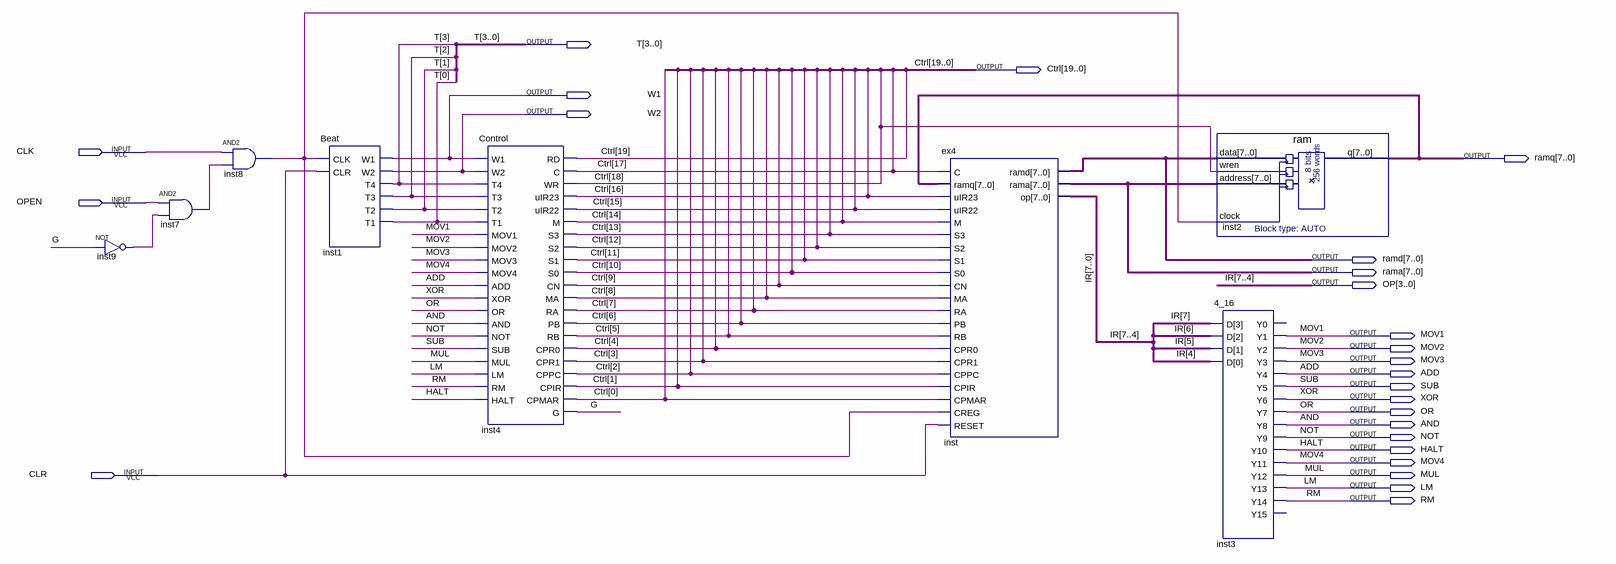
[diagram p0: schematic sheet]
// Quartus schematic lab4.bdf as structural Verilog: 8 symbols, 25 pins
module lab4 (
  input  CLK,
  input  OPEN,
  input  CLR,
  output [3:0] T,
  output [19:0] Ctrl,
  output W1,
  output W2,
  output [7:0] ramq,
  output [7:0] ramd,
  output [7:0] rama,
  output [3:0] OP,
  output MOV1,
  output MOV2,
  output MOV3,
  output ADD,
  output SUB,
  output XOR,
  output OR,
  output AND,
  output NOT,
  output HALT,
  output MOV4,
  output MUL,
  output LM,
  output RM
);

  wire G, inst7_out, inst8_out, inst9_out;
  wire [3:0] IR;

  not inst9 (inst9_out, G);
  and inst7 (inst7_out, OPEN, inst9_out);
  and inst8 (inst8_out, CLK, inst7_out);
  Beat inst1 (.CLK(inst8_out), .CLR(CLR), .W1(W1), .W2(W2), .T4(T[3]), .T3(T[2]), .T2(T[1]), .T1(T[0]));
  Control inst4 (
    .W1(W1), .W2(W2), .T4(T[3]), .T3(T[2]), .T2(T[1]), .T1(T[0]), .MOV1(MOV1), .MOV2(MOV2), .MOV3(MOV3),
    .MOV4(MOV4), .ADD(ADD), .XOR(XOR), .OR(OR), .AND(AND), .NOT(NOT), .SUB(SUB), .MUL(MUL), .LM(LM), .RM(RM),
    .HALT(HALT), .RD(Ctrl[19]), .C(Ctrl[17]), .WR(Ctrl[18]), .uIR23(Ctrl[16]), .uIR22(Ctrl[15]),
    .M(Ctrl[14]), .S3(Ctrl[13]), .S2(Ctrl[12]), .S1(Ctrl[11]), .S0(Ctrl[10]), .CN(Ctrl[9]), .MA(Ctrl[8]),
    .RA(Ctrl[7]), .PB(Ctrl[6]), .RB(Ctrl[5]), .CPR0(Ctrl[4]), .CPR1(Ctrl[3]), .CPPC(Ctrl[2]), .CPIR(Ctrl[1]),
    .CPMAR(Ctrl[0]), .G(G));
  ex4 inst (
    .C(Ctrl[17]), .ramq(ramq), .uIR23(Ctrl[16]), .uIR22(Ctrl[15]), .M(Ctrl[14]), .S3(Ctrl[13]),
    .S2(Ctrl[12]), .S1(Ctrl[11]), .S0(Ctrl[10]), .CN(Ctrl[9]), .MA(Ctrl[8]), .RA(Ctrl[7]), .PB(Ctrl[6]),
    .RB(Ctrl[5]), .CPR0(Ctrl[4]), .CPR1(Ctrl[3]), .CPPC(Ctrl[2]), .CPIR(Ctrl[1]), .CPMAR(Ctrl[0]),
    .CREG(inst8_out), .RESET(CLR), .ramd(ramd), .rama(rama), .op({OP, IR}));
  ram inst2 (.data(ramd), .wren(Ctrl[18]), .address(rama), .clock(inst8_out), .q(ramq));
  \4_16  inst3 (
    .D(OP), .Y1(MOV1), .Y2(MOV2), .Y3(MOV3), .Y4(ADD), .Y5(SUB), .Y6(XOR), .Y7(OR), .Y8(AND), .Y9(NOT),
    .Y10(HALT), .Y11(MOV4), .Y12(MUL), .Y13(LM), .Y14(RM));  // open: Y0, Y15

  // Other names for the same wires on the sheet: IR[7:4] = OP
endmodule
